# Altium project PCB_Tranca.PrjPcb
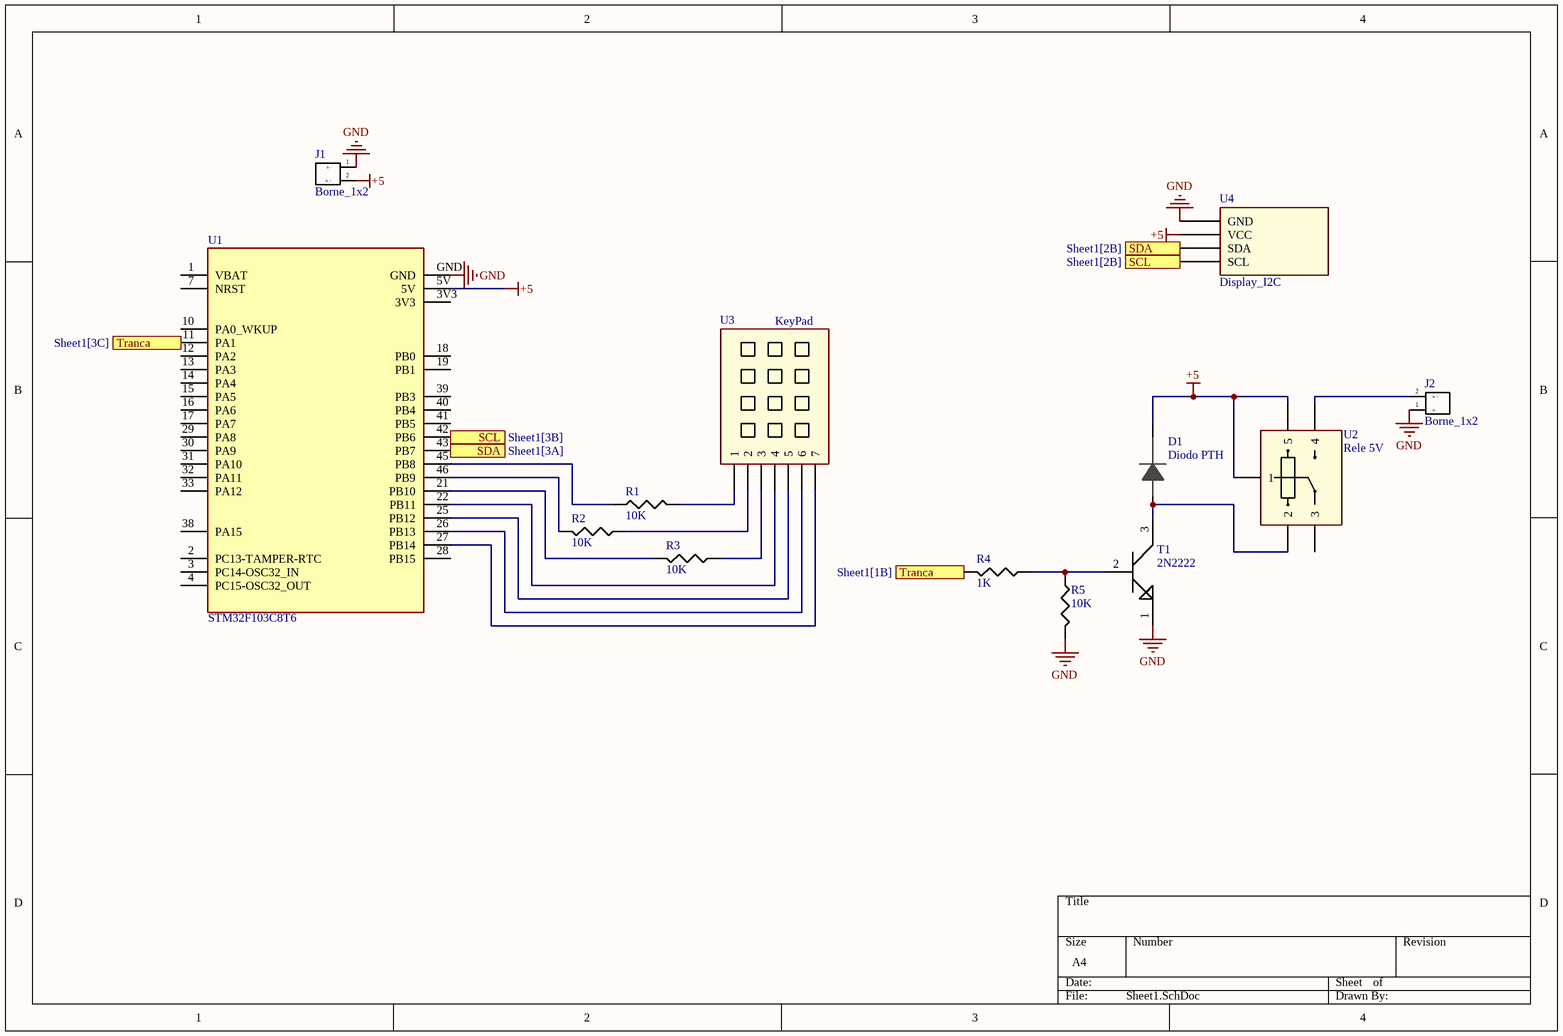
[diagram p0: Sheet1.SchDoc]
1 sheet, 13 parts. Net scope: flat (ports and power ports of the same name join across sheets).
Board file: PCB_Tranca.PcbDoc

## Sheet Sheet1.SchDoc
size A4; SheetNumber: 1; SheetTotal: 1

### Parts
D1  Diodo PTH  [DIODO]
J1  Borne_1x2  [Borne1x2]
J2  Borne_1x2  [Borne1x2]
R1  10K  [R_PTH]
R2  10K  [R_PTH]
R3  10K  [R_PTH]
R4  1K  [R_PTH]
R5  10K  [R_PTH]
T1  2N2222  [2N2222]
U1  STM32F103C8T6  [STM32]
U2  Rele 5V  [Rele]
U3  KeyPad  [KeyPad]
U4  Display_I2C  [LCD_I2C]

### Ports
SCL (see Sheet1[2B]), SCL (see Sheet1[3B]), SDA (see Sheet1[2B]), SDA (see Sheet1[3A]), Tranca (see Sheet1[1B]), Tranca (see Sheet1[3C])

### Nets
+5: D1.1 J1.2(In_+) U1.5V U2.1 U2.5 U4.2(VCC)
GND: J1.1(In_-) J2.1(In_-) R5.2 T1.1 U1.GND U4.1(GND)
NetD1_2: D1.2 T1.3 U2.2
NetJ2_2: J2.2(In_+) U2.4
NetR1_1: R1.1 U1.45(PB8)
NetR1_2: R1.2 U3.1
NetR2_1: R2.1 U3.2
NetR2_2: R2.2 U1.46(PB9)
NetR3_1: R3.1 U3.3
NetR3_2: R3.2 U1.21(PB10)
NetR4_1: R4.1 R5.1 T1.2
NetR4_2: R4.2 U1.11(PA1) ; port Tranca
NetU1_22: U1.22(PB11) U3.4
NetU1_25: U1.25(PB12) U3.5
NetU1_26: U1.26(PB13) U3.6
NetU1_27: U1.27(PB14) U3.7
NetU1_42: U1.42(PB6) U4.4(SCL) ; port SCL
NetU1_43: U1.43(PB7) U4.3(SDA) ; port SDA

Not connected (* = marked no-connect by the designer): U1 1(VBAT) 2(PC13-TAMPER-RTC) 3(PC14-OSC32_IN) 3V3 4(PC15-OSC32_OUT) 7(NRST) 10(PA0_WKUP) 12(PA2) 13(PA3) 14(PA4) 15(PA5) 16(PA6) 17(PA7) 18(PB0) 19(PB1) 28(PB15) 29(PA8) 30(PA9) 31(PA10) 32(PA11) 33(PA12) 38(PA15) 39(PB3) 40(PB4) 41(PB5); U2 3

### Library data of the parts
D1 = Diodo
R1-R5 = R_PTH_10k
U1 = STM32F103C8T6: ARM® Cortex®-M3 STM32F1 Microcontroller IC 32-Bit 72MHz 64KB (64K x 8) FLASH 48-LQFP (7x7); MF: STMicroelectronics; SnapEDA_Link: https://www.snapeda.com/parts/STM32F103C8T6/STMicroelectronics/view-part/?ref=snap; Package: LQFP-48 STMicroelectronics; Value: *; MP: STM32F103C8T6; Check_prices: https://www.snapeda.com/parts/STM32F103C8T6/STMicroelectronics/view-part/?ref=eda
U2 = Rele